# Altium schematic sheet secondary_EEPROM_and_T.SchDoc: foxBMS BMS-Slave 12-Cell
size A3; DocumentNumber: 20; SheetNumber: 20; SheetTotal: 21; AUTHOR: Fraunhofer IISB foxBMS Team; SheetDescription: Secondary EEPROM and Board T-Sensor
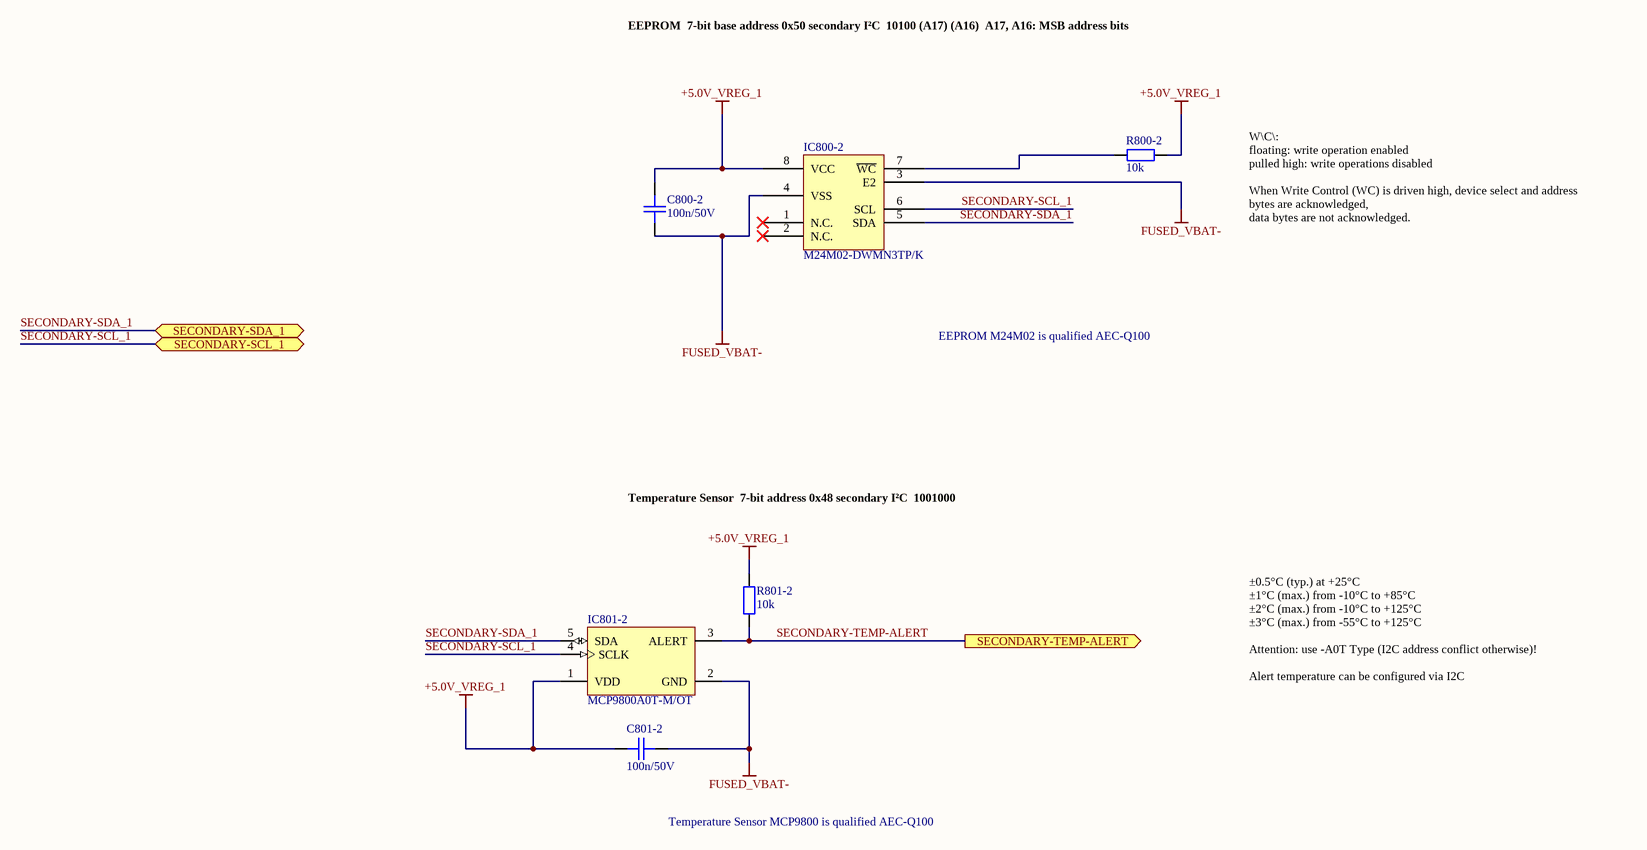
[diagram p0: secondary_EEPROM_and_T.SchDoc]

## Parts
C800-2  100n/50V  [CAPC1608X08N]
C801-2  100n/50V  [CAPC1608X08N]
IC800-2  M24M02-DWMN3TP/K  [SOIC127P600X175-8N]
IC801-2  MCP9800A0T-M/OT  [SOT-23-OT5_L]
R800-2  10k  [RESC1608X05N]
R801-2  10k  [RESC1608X05N]

## Ports
SECONDARY-SCL_1 (bidir), SECONDARY-SDA_1 (bidir), SECONDARY-TEMP-ALERT (out)

## Nets
+5.0V_VREG_1: C800-2.2 C801-2.2 IC800-2.8(VCC) IC801-2.1(VDD) R800-2.2 R801-2.2
FUSED_VBAT-: C800-2.1 C801-2.1 IC800-2.3(E2) IC800-2.4(VSS) IC801-2.2(GND)
SECONDARY-SCL_1: IC800-2.6(SCL) IC801-2.4(SCLK) ; port SECONDARY-SCL_1
SECONDARY-SDA_1: IC800-2.5(SDA) IC801-2.5(SDA) ; port SECONDARY-SDA_1
SECONDARY-TEMP-ALERT: IC801-2.3(ALERT) R801-2.1 ; port SECONDARY-TEMP-ALERT
NetIC800-2_7: IC800-2.7(~{WC}) R800-2.1

Not connected (* = marked no-connect by the designer): IC800-2 1(N.C.)* 2(N.C.)*

## Notes on the sheet
- EEPROM
  7-bit base address 0x50 secondary I²C
  10100 (A17) (A16)
  A17, A16: MSB address bits
- W\C\:
  floating: write operation enabled
  pulled high: write operations disabled
  When Write Control (WC) is driven high, device select and address bytes are acknowledged,
  data bytes are not acknowledged.
- EEPROM M24M02 is qualified AEC-Q100
- Temperature Sensor
  7-bit address 0x48 secondary I²C
  1001000
- ±0.5°C (typ.) at +25°C
  ±1°C (max.) from -10°C to +85°C
  ±2°C (max.) from -10°C to +125°C
  ±3°C (max.) from -55°C to +125°C
  Attention: use -A0T Type (I2C address conflict otherwise)!
  Alert temperature can be configured via I2C
- Temperature Sensor MCP9800 is qualified AEC-Q100
- Fraunhofer IISB
- Schottkystr. 10
- developed by:
- 91058 Erlangen
- Germany
- Author
- Project
- License
- Description
- File
- Version
- Release Date
- Sheet
- www.foxbms.org
- www.iisb.fraunhofer.de
- foxBMS Team
- /

## Library data of the parts
C800-2 C801-2 = gen_C_ceramic_100n_50V_X7R_0603: MLCC; Capacitance: 100n; Rated Voltage: 50V; Dielectric: X7R; Case EIA: 0603; Case Metric: 1608; PnP Package: C_0603_10; PnP Value: 100n/50V/X7R; PnP equipped: x; Automotive Qualified: False; Part Number: gen_C_ceramic_100n_50V_X7R_0603; Supplier 1: Farnell; Supplier Part Number 1: 2525267; Supplier 2: Digikey; Supplier Part Number 2: 490-6049-1-ND
IC800-2 = M24M02-DWMN3TP/K: Automotive 2-Mbit serial I²C / bus EEPROM with 1 MHz clock; Manufacturer: STMicroelectronics; PnP Package: SO8N; Automotive Qualified: True; Part Number: M24M02-DWMN3TP/K; Part Name: M24M02-DWMN3TP/K; Operating Temperature: -40°C - +125°C; ComponentLink1Description: Datasheet; ComponentLink1URL: http://www.st.com/content/ccc/resource/technical/document/datasheet/83/f4/3e/e4/4e/49/42/c5/DM00200595.pdf/files/DM00200595.pdf/jcr:content/translations/en.DM00200595.pdf; Supplier 1: Digikey; Supplier Part Number 1: 497-16238-1-ND; Supplier 2: Mouser; Supplier Part Number 2: 511-M24M02-DWMN3TP/K
IC801-2 = CMP-0192-00211-1: 2-Wire High-Accuracy Temperature Sensor, Slave Address 000, 5-Pin SOT-23, -55°C to +125°C Temperature, Tape and Reel; PackageReference: SOT-23-OT5; PackageVersion: revBB, Aug-2009; DatasheetVersion: revD, Nov-2010; PackageDescription: 5-Lead Plastic Small Outline Transistor (OT) [SOT-23]; Code_IPC: SOT23-5
R800-2 R801-2 = gen_R_10k_0603: SMD Resistor 10k 0603; Tolerance: 1%; Power: 0.1W; Case EIA: 0603; Case Metric: 1608; Maximum Working Voltage: 75V; PnP Package: R_0603; Automotive Qualified: False; Part Number: gen_R_10k_0603; Operating Temperature: -55°C - +155°C; Resistance: 10k; Series: E24, E96; PnP Value: 10k; Supplier 1: Farnell; Supplier Part Number 1: 2073349